# EAGLE design SparkFun_MicroSD_Sniffer (EAGLE 9.2.2)
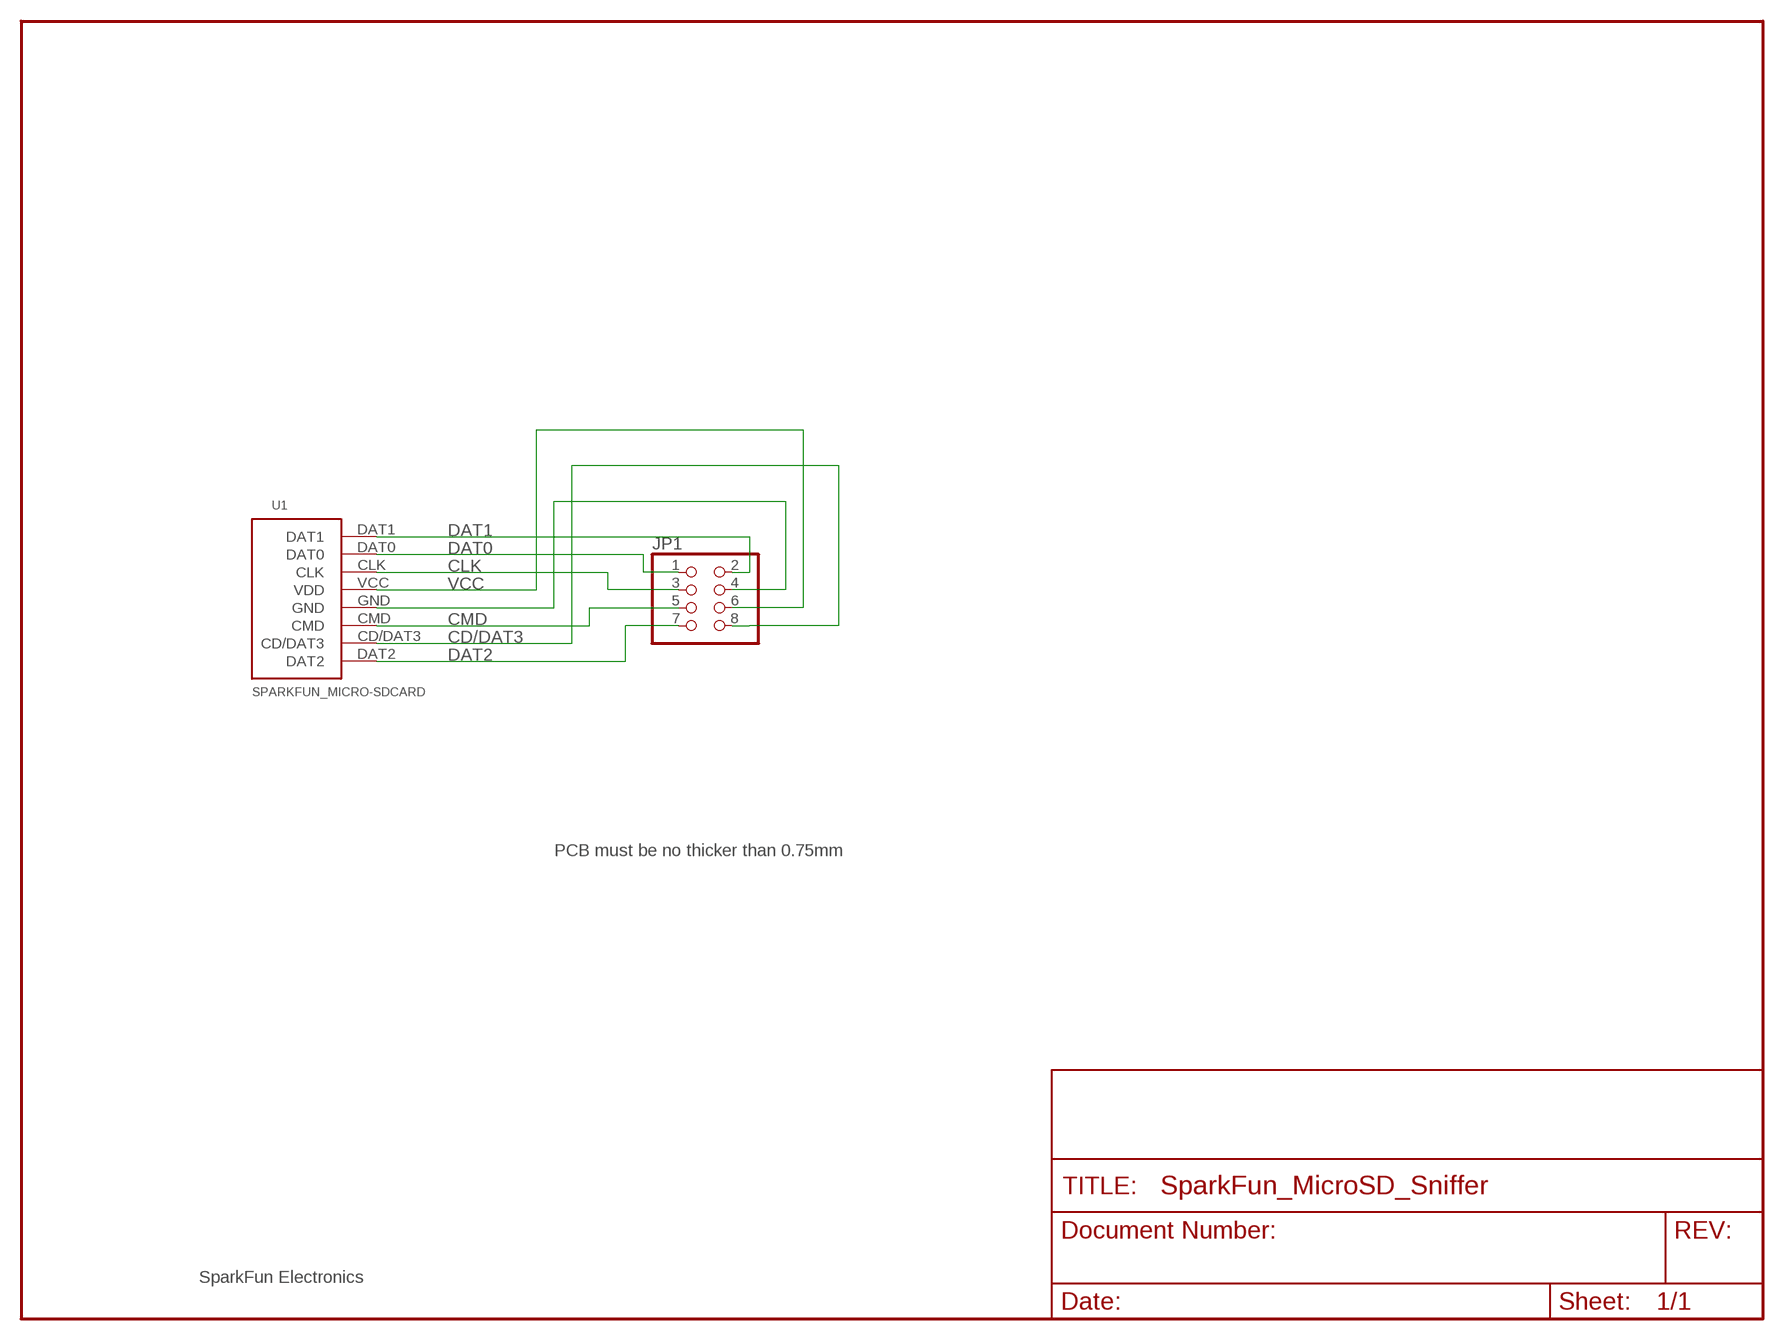
[diagram p0: schematic, sheet 1]

## Parts
JP1  PINHD-2X4  [2X04]
U1  SPARKFUN_MICRO-SDCARD  [SPARKFUN_MICRO-SDCARD]

## Nets
CD/DAT3: JP1.8 U1.CD/DAT3
CLK: JP1.3 U1.CLK
CMD: JP1.5 U1.CMD
DAT0: JP1.1 U1.DAT0
DAT1: JP1.2 U1.DAT1
DAT2: JP1.7 U1.DAT2
GND: JP1.4 U1.GND
VCC: JP1.6 U1.VCC(VDD)

## Notes on the sheet
- PCB must be no thicker than 0.75mm
- SparkFun Electronics

## Library data of the parts
JP1 = pinhead:PINHD-2X4: PIN HEADER
U1 = microsniffer-v14:SPARKFUN_MICRO-SDCARD

## Board
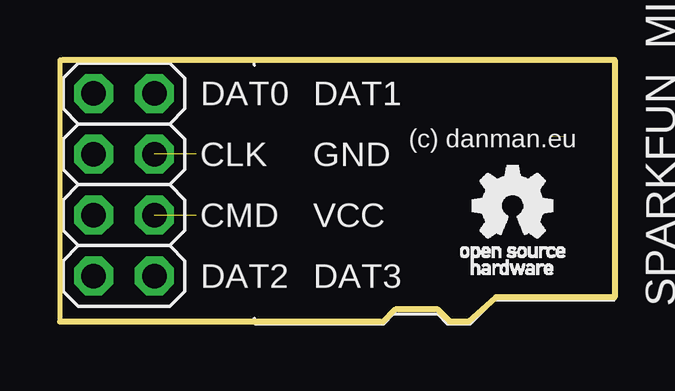
[diagram p1: board, top side]
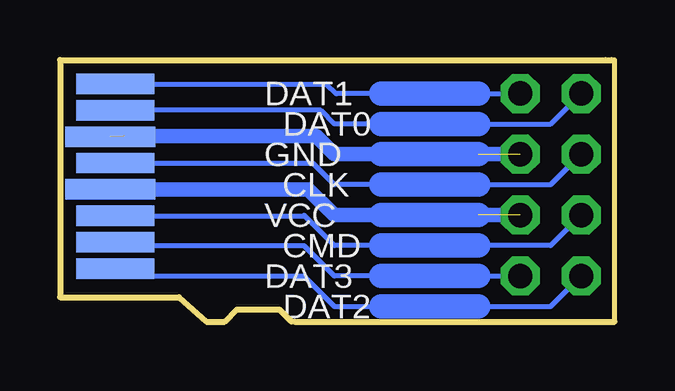
[diagram p2: board, bottom side, seen from below]

Size 23.11 x 10.92 mm. Coordinates in mm from the lower left corner, seen from the top.
Outline: 13.46,0 13.97,0.51 15.75,0.51 16.26,0 17.02,0 18.16,1.02 23.11,1.02 23.11,10.92 0.38,10.92
Outline: 0.38,10.92 0.13,10.92
Outline: 13.33,0 0,0 0,10.92 0.38,10.92
Copper layers (1*16): Top 0.035mm / dielectric 1.5mm / Bottom 0.035mm
Design rules "SparkFun": minimum track width 8mil, minimum drill 20mil, track to track 8mil, track to pad 8mil, pad to pad 8mil, via to via 8mil, smd to smd 8mil, copper to edge 9mil, drill to drill 8mil, minimum pad ring 12mil, minimum via ring 10mil, stop-mask expansion 4mil, vias tented up to drill 20mil, thermal gap 10mil

### Footprints (pad centres in the part's own frame; a part is rotated, then mirrored left to right if it is on the bottom)
2X04 = drill 1.016 octagon: 1 -3.81,-1.27; 2 -3.81,1.27; 3 -1.27,-1.27; 4 -1.27,1.27; 5 1.27,-1.27; 6 1.27,1.27; 7 3.81,-1.27; 8 3.81,1.27
SPARKFUN_MICRO-SDCARD = smd 0.85 x 3.25 bottom: CD/DAT3 2.56,2.3; CLK 5.86,2.3; CMD 3.66,2.3; DAT0 8.06,2.3; DAT1 9.16,2.3; DAT2 1.46,2.3 | smd 0.85 x 3.75 bottom: GND 6.96,2.1; VCC 4.76,2.1

### Placement (x,y rotation side)
JP1  2.67,5.71 270 top
U1  23.11,0.76 90 top

### Tracks (layer width: path | path; a pad name or v marks a point on that pad's centre or on a via)
CD/DAT3
  Bottom 0.203: U1.CD/DAT3 20.67,3.17 12.95,3.17 11.68,1.91 9.73,1.91 | 5.68,1.91 JP1.8
  Bottom 1.016: 9.73,1.91 5.68,1.91
CLK
  Bottom 0.203: U1.CLK 12.59,6.62 11.68,5.71 9.73,5.71 | JP1.3 2.67,5.71 5.68,5.71
  Bottom 1.016: 9.73,5.71 5.68,5.71
CMD
  Bottom 0.203: U1.CMD 12.98,4.42 12.95,4.44 11.68,3.17 9.73,3.17 | 5.68,3.17 2.67,3.17 JP1.5
  Bottom 1.016: 5.68,3.17 9.73,3.17
DAT0
  Bottom 0.203: U1.DAT0 12.25,8.82 11.68,8.25 9.73,8.25 | JP1.1 2.67,8.25 5.68,8.25
  Bottom 1.016: 9.73,8.25 5.68,8.25
DAT1
  Bottom 0.203: U1.DAT1 12.01,9.92 11.59,9.51 9.73,9.51 | 5.68,9.51 3.96,9.51 JP1.2
  Bottom 1.016: 9.73,9.51 5.68,9.51
DAT2
  Bottom 0.203: U1.DAT2 20.5,1.91 12.95,1.91 11.68,0.63 9.73,0.63 | 5.68,0.63 2.67,0.63 JP1.7
  Bottom 1.016: 5.68,0.63 9.73,0.63
GND  (2 unrouted)
  Bottom 0.61: JP1.4 11.68,6.99 12.45,7.75 20.45,7.75
  Bottom 1.016: 5.68,6.99 9.73,6.99
VCC  (1 unrouted)
  Bottom 0.61: JP1.6 11.68,4.44 12.76,5.52 U1.VCC
  Bottom 1.016: 9.73,4.44 5.68,4.44

### Text on the board
tPlace: DAT0 | DAT1 | (c) danman.eu | CLK | GND | CMD | VCC | DAT2 | DAT3
bNames: DAT1 | DAT0 | GND | CLK | VCC | CMD | DAT3 | DAT2